# EAGLE design schematic_1 (EAGLE 8.7.1)
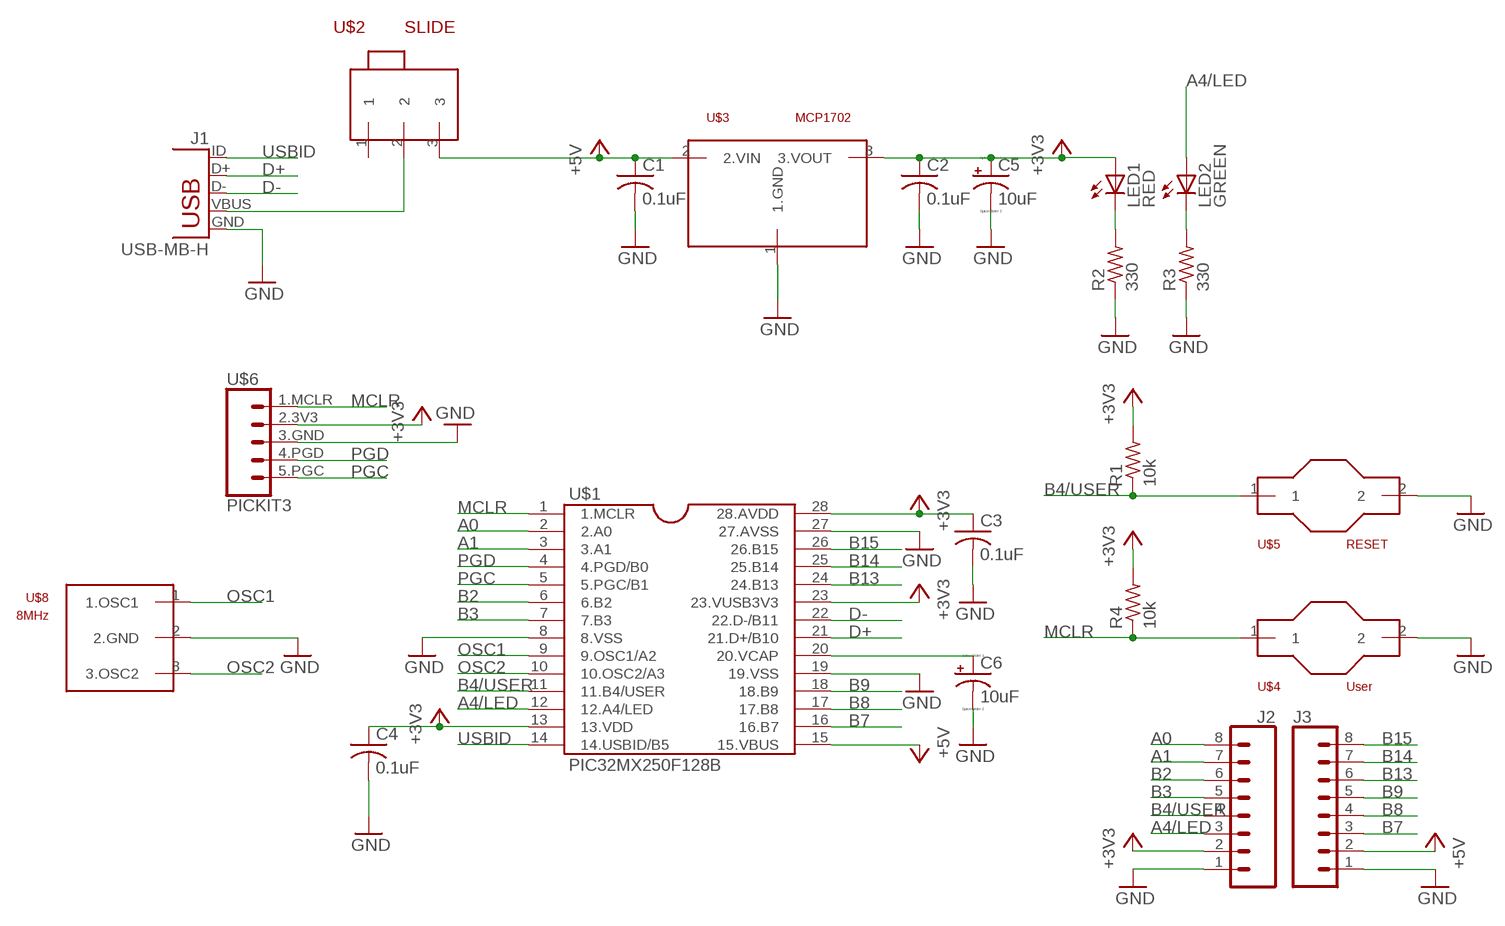
[diagram p0: schematic, sheet 1]

## Parts
C1  0.1uF  C-US025-025X050  [C025-025X050]
C2  0.1uF  C-US025-025X050  [C025-025X050]
C3  0.1uF  C-US025-025X050  [C025-025X050]
C4  0.1uF  C-US025-025X050  [C025-025X050]
C5  10uF  CPOL-USB45181B  [B45181B]
C6  10uF  CPOL-USB45181B  [B45181B]
J1  USB-MB-H  [USB-MB-H]
J2  CONN_08"  [1X08]
J3  CONN_08"  [1X08]
LED1  RED  LED3MM  [LED3MM]
LED2  GREEN  LED3MM  [LED3MM]
R1  10k  R-US_0207/10  [0207/10]
R2  330  R-US_0207/10  [0207/10]
R3  330  R-US_0207/10  [0207/10]
R4  10k  R-US_0207/10  [0207/10]
U$1  PIC32MX250F128B  [DIL28-3]
U$2  SLIDE  [SLIDE]
U$3  MCP1702  [TO92]
U$4  User  BUTTON  [BUTTON]
U$5  RESET  BUTTON  [BUTTON]
U$6  PICKIT3  [PICKIT3]
U$8  8MHz  OSC  [OSC]

## Nets
+3V3: C2.1 C3.1 C4.1 C5.+ J2.2 LED1.A R1.2 R4.2 U$1.13(13.VDD) U$1.23(23.VUSB3V3) U$1.28(28.AVDD) U$3.3(3.VOUT) U$6.2.3V3(2.VDD)
+5V: C1.1 J3.2 U$1.15(15.VBUS) U$2.3 U$3.2(2.VIN)
A0: J2.8 U$1.2(2.A0)
A1: J2.7 U$1.3(3.A1)
A4/LED: J2.3 LED2.A U$1.12(12.A4/LED)
B2: J2.6 U$1.6(6.B2)
B3: J2.5 U$1.7(7.B3)
B4/USER: J2.4 R1.1 U$1.11(11.B4/USER) U$5.1
B7: J3.3 U$1.16(16.B7)
B8: J3.4 U$1.17(17.B8)
B9: J3.5 U$1.18(18.B9)
B13: J3.6 U$1.24(24.B13)
B14: J3.7 U$1.25(25.B14)
B15: J3.8 U$1.26(26.B15)
D+: J1.D+ U$1.21(21.D+/B10)
D-: J1.D- U$1.22(22.D-/B11)
GND: C1.2 C2.2 C3.2 C4.2 C5.- C6.- J1.GND J2.1 J3.1 R2.1 R3.1 U$1.8(8.VSS) U$1.19(19.VSS) U$1.27(27.AVSS) U$3.1(1.GND) U$4.2 U$5.2 U$6.3.GND U$8.2(2.GND)
MCLR: R4.1 U$1.1(1.MCLR) U$4.1 U$6.1.MCLR
N$3: LED2.K(C) R3.2
N$6: J1.VBUS U$2.2
N$7: C6.+ U$1.20(20.VCAP)
N$8: LED1.K(C) R2.2
OSC1: U$1.9(9.OSC1/A2) U$8.1(1.OSC1)
OSC2: U$1.10(10.OSC2/A3) U$8.3(3.OSC2)
PGC: U$1.5(5.PGC/B1) U$6.5.PGC
PGD: U$1.4(4.PGD/B0) U$6.4.PGD
USBID: J1.ID U$1.14(14.USBID/B5)
Unconnected: U$2.1

## Library data of the parts
C1-C4 = custom:C-US: CAPACITOR, American symbol
C5 C6 = custom:CPOL-US: POLARIZED CAPACITOR, American symbol
J1 = custom:USB: USB Connectors USB-B-PTH is fully proven SKU : PRT-00139/CONN-08278 USB-miniB is fully proven SKU : PRT-00587 USB-A-PCB is untested. USB-A-H is throughly reviewed, but untested. Spark Fun Electronics SKU : PRT-00437 USB-B-SMT is throughly reviewed, but untested. Needs silkscreen touching up. USB-A-S has not been used/tested USB-MB-H has not been used/tested USB-MICROB has been used. CONN-09505
J2 J3 = custom:CONN_08: Multi connection point. Often used as Generic Header-pin footprint for 0.1 inch spaced/style header connections On any of the 0.1 inch spaced packages, you can populate with these: Break Away Headers - Straight <https://www.sparkfun.com/products/116> (PRT-00116) Break Away Male Headers - Right Angle <https://www.sparkfun.com/products/553> (PRT-00553) Female Headers <https://www.sparkfun.com/products/115> (PRT-00115) Break Away Headers - Machine Pin <https://www.sparkfun.com/products/117> (PRT-00117) Break Away Female Headers - Swiss Machine Pin <https://www.sparkfun.com/products/743> (PRT-00743) Arduino Stackable Header - 8 Pin <https://www.sparkfun.com/products/9279> (PRT-09279) For SCREWTERMINALS and SPRING TERMINALS visit here: Screw Terimnals on SparkFun.com <https://www.sparkfun.com/search/results?term=Screw+Terminals> (5mm/3.5mm/2.54mm spacing) This device is also useful as a general connection point to wire up your design to another part of your project. Our various solder wires solder well into these plated through hole pads. Hook-Up Wire - Assortment (Stranded, 22 AWG) <https://www.sparkfun.com/products/11375> (PRT-11375) Hook-Up Wire - Assortment (Solid Core, 22 AWG) <https://www.sparkfun.com/products/11367> (PRT-11367) View the entire wire category on our website here <https://www.sparkfun.com/categories/141> Special notes: Molex polarized connector foot print use with SKU : PRT-08231 with associated crimp pins and housings. 1MM SMD Version SKU: PRT-10208 NOTES ON THE VARIANTS LOCK and LOCK_LONGPADS... This footprint was designed to help hold the alignment of a through-hole component (i.e. 6-pin header) while soldering it into place. You may notice that each hole has been shifted either up or down by 0.005 of an inch from it's more standard position (which is a perfectly straight line). This slight alteration caused the pins (the squares in the middle) to touch the edges of the holes. Because they are alternating, it causes a "brace" to hold the component in place. 0.005 has proven to be the perfect amount of "off-center" position when using our standard breakaway headers. Although looks a little odd when you look at the bare footprint, once you have a header in there, the alteration is very hard to notice. Also,if you push a header all the way into place, it is covered up entirely on the bottom side.; PROD_ID: CONN-08438
LED1 LED2 = custom:LED: LED OSRAM: - CHIPLED LG R971, LG N971, LY N971, LG Q971, LY Q971, LO R971, LY R971 LH N974, LH R974 LS Q976, LO Q976, LY Q976 LO Q996 - Hyper CHIPLED LW Q18S LB Q993, LB Q99A, LB R99A - SideLED LS A670, LO A670, LY A670, LG A670, LP A670 LB A673, LV A673, LT A673, LW A673 LH A674 LY A675 LS A676, LA A676, LO A676, LY A676, LW A676 LS A679, LY A679, LG A679 - Hyper Micro SIDELED® LS Y876, LA Y876, LO Y876, LY Y876 LT Y87S - SmartLED LW L88C, LW L88S LB L89C, LB L89S, LG L890 LS L89K, LO L89K, LY L89K LS L896, LA L896, LO L896, LY L896 - TOPLED LS T670, LO T670, LY T670, LG T670, LP T670 LSG T670, LSP T670, LSY T670, LOP T670, LYG T670 LG T671, LOG T671, LSG T671 LB T673, LV T673, LT T673, LW T673 LH T674 LS T676, LA T676, LO T676, LY T676, LB T676, LH T676, LSB T676, LW T676 LB T67C, LV T67C, LT T67C, LS T67K, LO T67K, LY T67K, LW E67C LS E67B, LA E67B, LO E67B, LY E67B, LB E67C, LV E67C, LT E67C LW T67C LS T679, LY T679, LG T679 LS T770, LO T770, LY T770, LG T770, LP T770 LB T773, LV T773, LT T773, LW T773 LH T774 LS E675, LA E675, LY E675, LS T675 LS T776, LA T776, LO T776, LY T776, LB T776 LHGB T686 LT T68C, LB T68C - Hyper Mini TOPLED® LB M676 - Mini TOPLED Santana® LG M470 LS M47K, LO M47K, LY M47K Source: http://www.osram.convergy.de LUXEON: - LUMILED® LXK2-PW12-R00, LXK2-PW12-S00, LXK2-PW14-U00, LXK2-PW14-V00 LXK2-PM12-R00, LXK2-PM12-S00, LXK2-PM14-U00 LXK2-PE12-Q00, LXK2-PE12-R00, LXK2-PE12-S00, LXK2-PE14-T00, LXK2-PE14-U00 LXK2-PB12-K00, LXK2-PB12-L00, LXK2-PB12-M00, LXK2-PB14-N00, LXK2-PB14-P00, LXK2-PB14-Q00 LXK2-PR12-L00, LXK2-PR12-M00, LXK2-PR14-Q00, LXK2-PR14-R00 LXK2-PD12-Q00, LXK2-PD12-R00, LXK2-PD12-S00 LXK2-PH12-R00, LXK2-PH12-S00 LXK2-PL12-P00, LXK2-PL12-Q00, LXK2-PL12-R00 Source: www.luxeon.com KINGBRIGHT: KA-3528ASYC Source: www.kingbright.com
R1-R4 = custom:R-US_: RESISTOR, American symbol
U$1 = custom:PIC32MX250F128B
U$2 = custom:SLIDE
U$3 = custom:MCP1702
U$4 U$5 = custom:BUTTON
U$6 = custom:PICKIT3
U$8 = custom:OSC

## Board
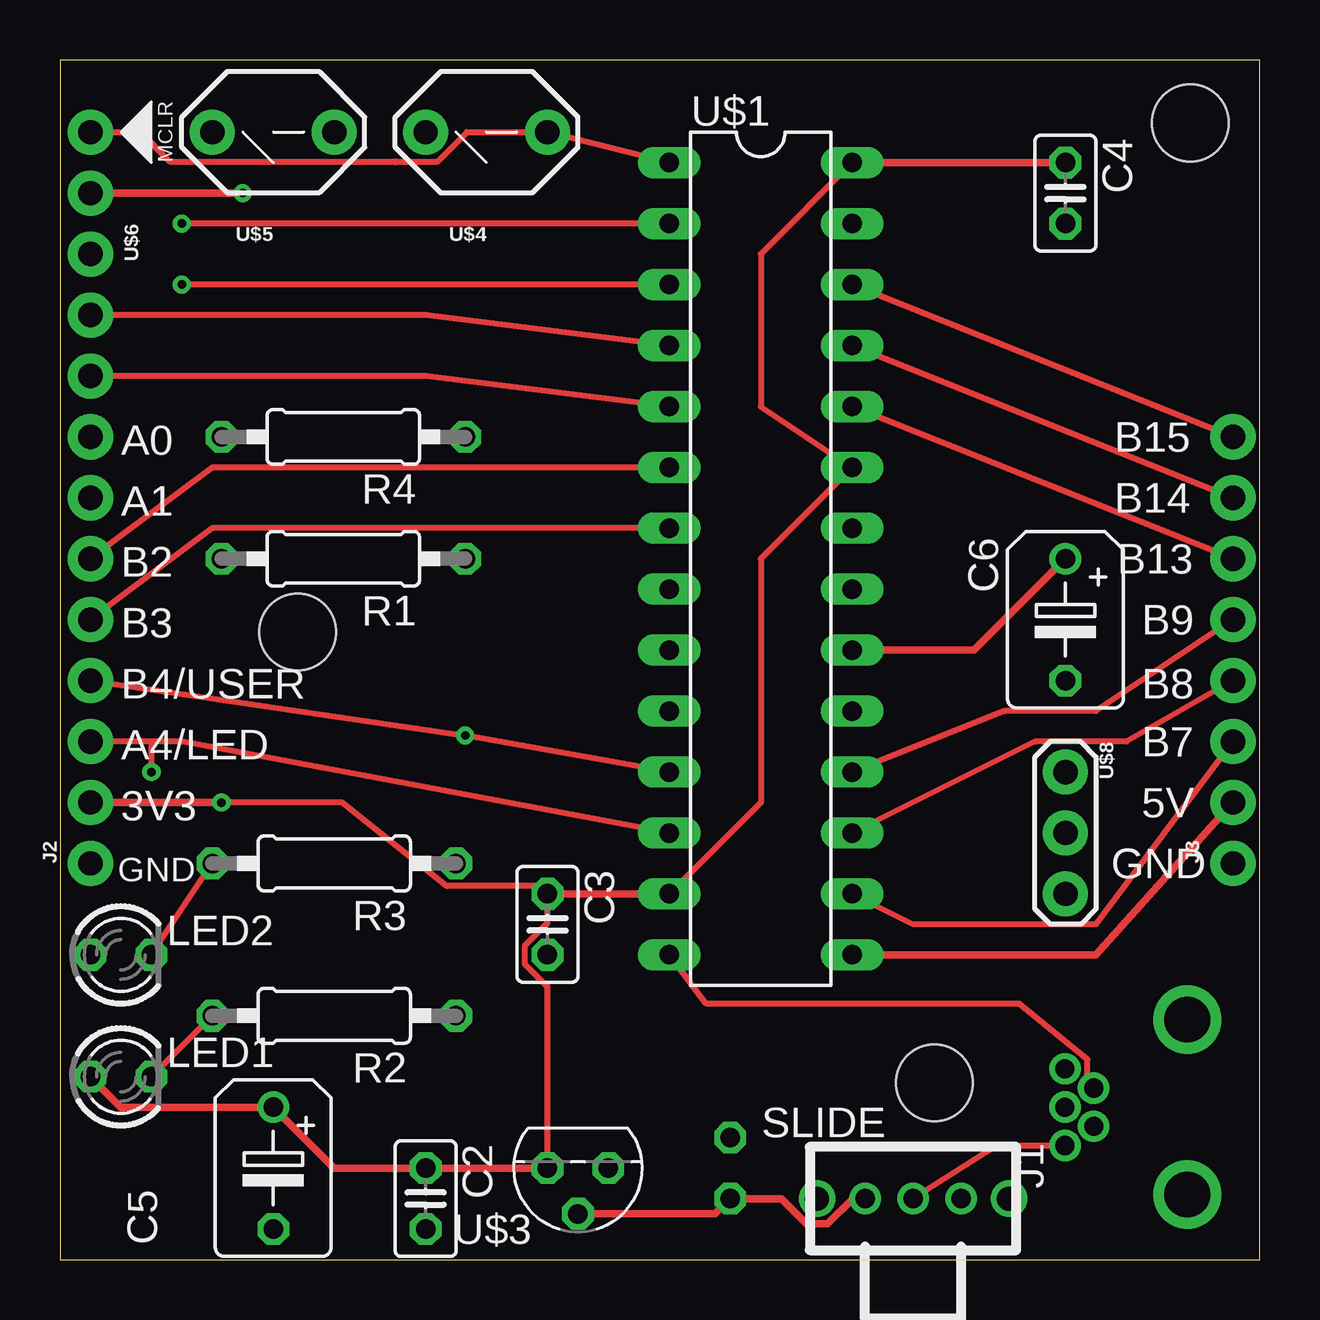
[diagram p1: board, top side]
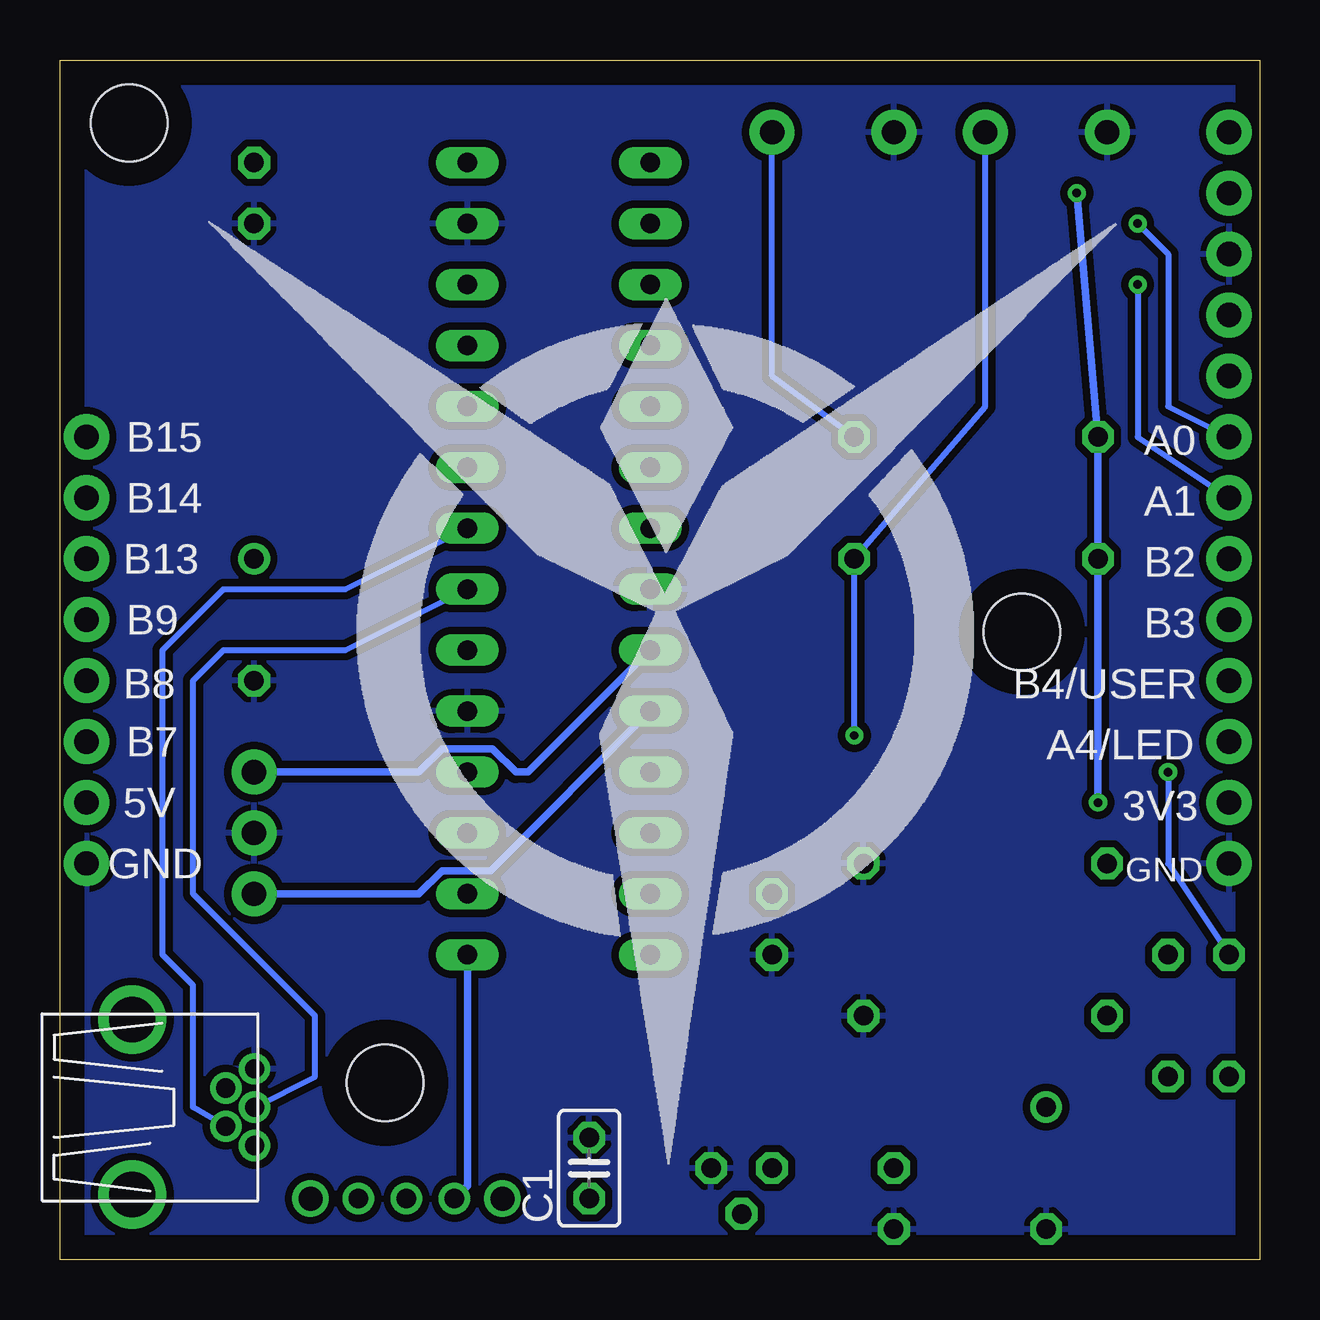
[diagram p2: board, bottom side, seen from below]

Size 50 x 50 mm. Coordinates in mm from the lower left corner, seen from the top.
Outline: 0,0 50,0 50,50 0,50 0,0
Copper layers (1*16): Top 0.035mm / dielectric 1.5mm / Bottom 0.035mm
Design rules "default": minimum track width 6mil, minimum drill 0.35mm, track to track 6mil, track to pad 6mil, pad to pad 6mil, via to via 6mil, smd to smd 6mil, copper to edge 40mil, drill to drill 6mil, minimum pad ring 10mil, minimum via ring 8mil, stop-mask expansion 4mil, vias tented up to drill 0mil, thermal gap 10mil
Holes 3.2 mm at 47.12,47.37 36.45,7.37 9.91,26.16

### Footprints (pad centres in the part's own frame; a part is rotated, then mirrored left to right if it is on the bottom)
C025-025X050 = drill 0.813 octagon: 1 -1.27,0; 2 1.27,0
B45181B = drill 0.813: + -2.54,0 | drill 0.813 octagon: - 2.54,0
USB-MB-H = drill 0.8: D+ 5.1,0; D- 3.9,0.8; GND 5.1,-1.6; ID 3.9,-0.8; VBUS 5.1,1.6 | drill 1.9: P$6 0,-3.65; P$7 0,3.65
1X08 = drill 1.016 pad 1.88: 1 0,0; 2 2.54,0; 3 5.08,0; 4 7.62,0; 5 10.16,0; 6 12.7,0; 7 15.24,0; 8 17.78,0
LED3MM = drill 0.813 octagon: A -1.27,0; K 1.27,0
0207/10 = drill 0.813 octagon: 1 -5.08,0; 2 5.08,0
DIL28-3 = drill 0.813 long: 1 -16.51,-3.81; 2 -13.97,-3.81; 3 -11.43,-3.81; 4 -8.89,-3.81; 5 -6.35,-3.81; 6 -3.81,-3.81; 7 -1.27,-3.81; 8 1.27,-3.81; 9 3.81,-3.81; 10 6.35,-3.81; 11 8.89,-3.81; 12 11.43,-3.81; 13 13.97,-3.81; 14 16.51,-3.81; 15 16.51,3.81; 16 13.97,3.81; 17 11.43,3.81; 18 8.89,3.81; 19 6.35,3.81; 20 3.81,3.81; 21 1.27,3.81; 22 -1.27,3.81; 23 -3.81,3.81; 24 -6.35,3.81; 25 -8.89,3.81; 26 -11.43,3.81; 27 -13.97,3.81; 28 -16.51,3.81
SLIDE = drill 0.8: 1 -2,0; 2 0,0; 3 2,0 | drill 1: P$1 -4,0; P$2 4,0
TO92 = drill 0.813 octagon: 1 -1.27,0; 2 0,1.905; 3 1.27,0
BUTTON = drill 1.016 pad 1.88: 1 -2.54,0; 2 2.54,0
PICKIT3 = drill 1.016 pad 1.88: 1.MCLR -5.08,0; 2.3V3 -2.54,0; 3.GND 0,0; 4.PGD 2.54,0; 5.PGC 5.08,0
OSC = drill 1.016 pad 1.88: 1 -2.54,0; 2 0,0; 3 2.54,0

### Placement (x,y rotation side)
C1  27.94,3.81 90 bottom
C2  15.24,2.54 270 top
C3  20.32,13.97 270 top
C4  41.91,44.45 270 top
C5  8.89,3.81 270 top
C6  41.91,26.67 270 top
J1  46.99,6.35 180 top
J2  1.27,16.51 90 top
J3  48.9,16.51 90 top
LED1  2.54,7.62 0 top
LED2  2.54,12.7 0 top
R1  11.81,29.21 180 top
R2  11.43,10.16 180 top
R3  11.43,16.51 180 top
R4  11.81,34.29 180 top
U$1  29.21,29.21 270 top
U$2  35.56,2.54 180 top
U$3  21.59,3.81 180 top
U$4  17.78,46.99 180 top
U$5  8.89,46.99 180 top
U$6  1.27,41.91 270 top
U$8  41.91,17.78 270 top

### Tracks (layer width: path | path; a pad name or v marks a point on that pad's centre or on a via)
+3V3  (via drill 0.35)
  Top 0.254: U$1.13 29.21,19.05 29.21,29.21 U$1.23 29.21,35.56 29.21,41.91 U$1.28 | U$3.3 20.32,11.37 19.38,12.31 19.38,13.09 20.32,14.03 C3.1 19.99,15.57 16.12,15.57 11.75,19.05 v6.73,19.05
  Top 0.305: U$1.13 C3.1 | U$3.3 C2.1 11.43,3.81 C5.+ 2.54,6.35 LED1.A | U$1.28 C4.1 | v6.73,19.05 J2.2 | v7.62,44.45 U$6.2.3V3
  Bottom 0.305: v6.73,19.05 R1.2 R4.2 v7.62,44.45
+5V
  Top 0.305: U$2.3 33.06,2.54 32,1.48 31.12,1.48 30.06,2.54 C1.1 27.3,1.91 U$3.2 | J3.2 43.18,12.7 U$1.15
  Bottom 0.305: U$2.3 33.02,3.08 U$1.15
A0  (via drill 0.35)
  Top 0.254: U$1.2 v5.08,43.18
  Bottom 0.254: v5.08,43.18 3.81,41.91 3.81,35.56 J2.8
A1  (via drill 0.35)
  Top 0.254: U$1.3 v5.08,40.64
  Bottom 0.254: v5.08,40.64 5.08,34.29 J2.7
A4/LED  (via drill 0.35)
  Top 0.254: U$1.12 5.08,21.59 3.81,21.59 | 3.81,21.59 J2.3 | 3.81,21.59 v3.81,20.32
  Bottom 0.254: v3.81,20.32 3.81,16.51 LED2.A
B2
  Top 0.254: U$1.6 6.35,33.02 J2.6
B3
  Top 0.254: U$1.7 6.35,30.48 J2.5
B4/USER  (via drill 0.35)
  Top 0.254: U$1.11 v16.89,21.84 J2.4
  Bottom 0.254: U$5.1 11.43,35.56 R1.1 v16.89,21.84
B7
  Top 0.254: J3.3 43.18,13.97 35.56,13.97 U$1.16
B8
  Top 0.254: J3.4 44.45,21.59 40.64,21.59 U$1.17
B9
  Top 0.254: J3.5 43.18,22.86 39.37,22.86 U$1.18
B13
  Top 0.254: J3.6 U$1.24
B14
  Top 0.254: J3.7 U$1.25
B15
  Top 0.254: J3.8 U$1.26
D+
  Bottom 0.254: J1.D+ 39.37,7.62 39.37,10.16 44.45,15.24 44.45,24.13 43.18,25.4 38.1,25.4 U$1.21
D-
  Bottom 0.254: J1.D- 44.45,6.35 44.45,11.43 45.72,12.7 45.72,25.4 43.18,27.94 38.1,27.94 U$1.22
GND
  pour Bottom (isolate 0.305): -1.27,-1.27 52.07,-1.27 52.07,50.8 -1.27,50.8
MCLR
  Top 0.254: U$1.1 U$4.1 16.96,46.99 15.74,45.77 14.02,45.77 13.97,45.72 13.92,45.77 4.58,45.77 3.36,46.99 U$6.1.MCLR
  Bottom 0.254: R4.1 20.32,36.83 U$4.1
N$3
  Top 0.254: LED2.K R3.2
N$6
  Top 0.254: J1.VBUS 39.04,4.75 U$2.2
N$7
  Top 0.305: U$1.20 38.1,25.4 C6.+
N$8
  Top 0.254: LED1.K R2.2
OSC1
  Bottom 0.305: U$1.9 30.48,20.32 31,20.32 31.96,21.29 34.08,21.29 35.05,20.32 U$8.1
OSC2
  Bottom 0.305: U$1.10 32.05,16.2 34.08,16.2 35.05,15.24 U$8.3
PGC
  Top 0.254: U$1.5 15.24,36.83 U$6.5.PGC
PGD
  Top 0.254: U$1.4 15.24,39.37 U$6.4.PGD
USBID
  Top 0.254: J1.ID 42.82,7.42 42.82,8.34 39.99,10.66 26.93,10.66 U$1.14

### Text on the board
tPlace: MCLR | A0 | B15 | A1 | B14 | B13 | B2 | B3 | B9 | B4/USER | B8 | A4/LED | B7 | 3V3 | 5V | GND | GND
bPlace: A0 | B15 | A1 | B14 | B13 | B2 | B3 | B9 | B4/USER | B8 | A4/LED | B7 | 3V3 | 5V | GND | GND